# EAGLE schematic example (EAGLE 9.6.2)
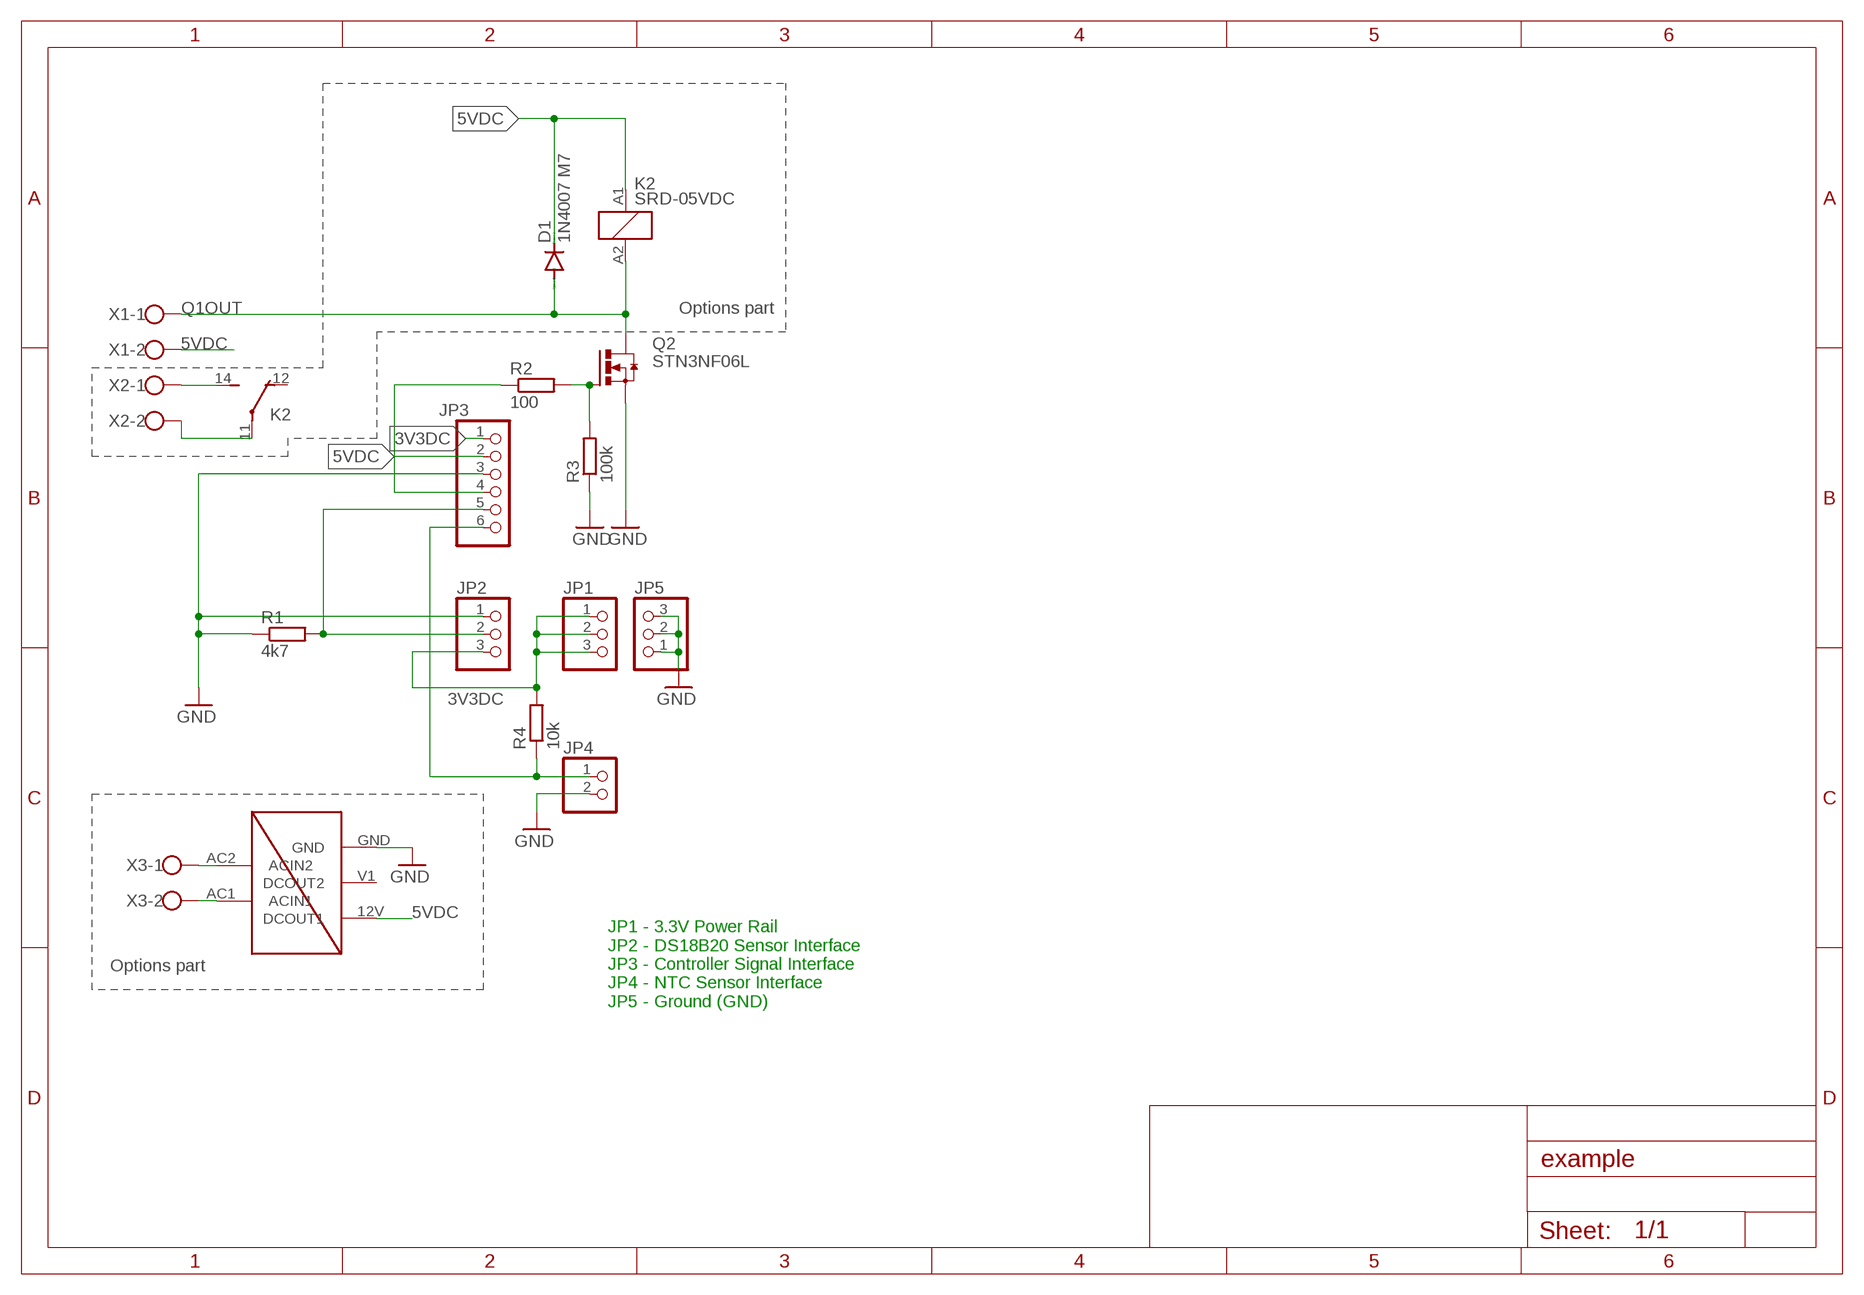
[diagram p0: schematic, sheet 1]

## Parts
D1  1N4007 M7  DIODE-DO-214AC  [DO-214AC]
JP1  PINHD-1X3  [1X03]
JP2  PINHD-1X3  [1X03]
JP3  PINHD-1X6  [1X06]
JP4  PINHD-1X2  [1X02]
JP5  PINHD-1X3  [1X03]
K2  SRD-05VDC  ZNS5106  [ZN5]
PW  SUPPLY12-V05  [SUPPLY-12V04]
Q2  STN3NF06L  N-HEXFET-2D_SOT232-  [SOT223]
R1  4k7  R-EU_M1206  [M1206]
R2  100  R-EU_R1206  [R1206]
R3  100k  R-EU_R1206  [R1206]
R4  10k  R-EU_R1206  [R1206]
X1  W237-102  [W237-102]
X2  W237-102  [W237-102]
X3  W237-102  [W237-102]

## Nets
3V3DC: JP1.1 JP1.2 JP1.3 JP2.3 JP3.1 R4.2
5VDC: D1.C JP3.2 K2.A1 PW.12V(DCOUT1) X1.2
AC1 [230ac]: PW.AC2(ACIN2) X3.1
AC2 [230ac]: PW.AC1(ACIN1) X3.2
GND: JP2.1 JP3.3 JP4.2 JP5.1 JP5.2 JP5.3 PW.GND Q2.3(S) R1.1 R3.1
N$1: Q2.1(G) R2.2 R3.2
N$2 [power]: K2.14(2:S) X2.1
N$4: JP3.4 R2.1
N$5: JP2.2 JP3.5 R1.2
N$7 [power]: K2.11(2:P) X2.2
N$9: JP3.6 JP4.1 R4.1
Q1OUT [power]: D1.A K2.A2 Q2.2(D) Q2.4(D) X1.1
Unconnected: K2.12(2:O) PW.V1(DCOUT2)

## Notes on the sheet
- Options part
- Options part
- JP1 - 3.3V Power Rail
  JP2 - DS18B20 Sensor Interface
  JP3 - Controller Signal Interface
  JP4 - NTC Sensor Interface
  JP5 - Ground (GND)

## Library data of the parts
D1 = diode:DIODE-: DIODE
JP1 JP2 JP5 = pinhead:PINHD-1X3: PIN HEADER
JP3 = pinhead:PINHD-1X6: PIN HEADER
JP4 = pinhead:PINHD-1X2: PIN HEADER
K2 = relay:ZNS5*: Miniature Power PCB Relay SCHRACK 1pole 10 A Source: http://www.schrack.com/.. 5847.pdf; OC_FARNELL: unknown; OC_NEWARK: unknown
PW = pw:SUPPLY12-V05
Q2 = transistor-power:N-HEXFET-2D_?-*: HEXFET® Power MOSFET 2 Drain connects http://www.irf.com/product-info/datasheets/data/irll014n.pdf
R1-R4 = rcl:R-EU_: RESISTOR, European symbol; SPICEPREFIX: R
X1-X3 = con-wago-500:W237-102: WAGO SCREW CLAMP; MPN: 237-102; OC_FARNELL: unknown; OC_NEWARK: 70K9898

## Net classes
0 default: width 0.3 mm, drill 0.013 mm, clearance 0.4 mm
1 power: width 0.75 mm, drill 0.5 mm, clearance 0.4 mm
2 230ac: width 0.3 mm, drill 0.013 mm, clearance 0.8 mm